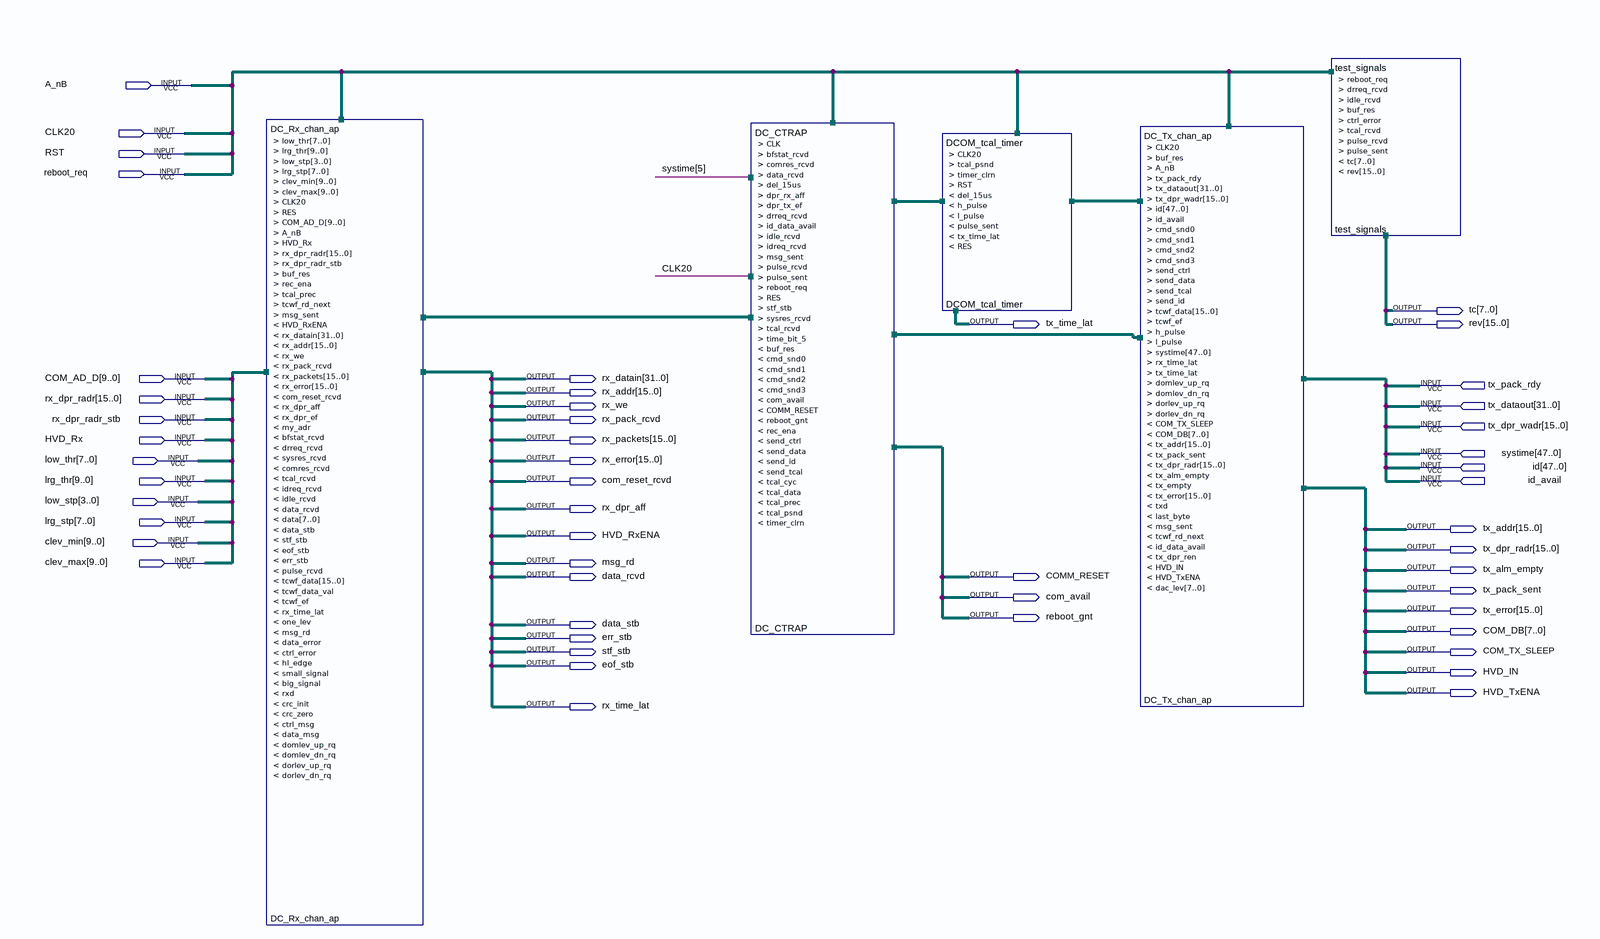
[diagram p0: schematic sheet]
// Quartus schematic dcom_ap_dct.bdf as structural Verilog: 5 symbols, 51 pins
module dcom_ap_dct (
  input  A_nB,
  input  CLK20,
  input  RST,
  input  reboot_req,
  input  [9:0] COM_AD_D,
  input  tx_pack_rdy,
  input  [15:0] rx_dpr_radr,
  input  [31:0] tx_dataout,
  input  rx_dpr_radr_stb,
  input  [15:0] tx_dpr_wadr,
  input  HVD_Rx,
  input  [47:0] systime,
  input  [7:0] low_thr,
  input  [47:0] id,
  input  [9:0] lrg_thr,
  input  id_avail,
  input  [3:0] low_stp,
  input  [7:0] lrg_stp,
  input  [9:0] clev_min,
  input  [9:0] clev_max,
  output [7:0] tc,
  output tx_time_lat,
  output [15:0] rev,
  output [31:0] rx_datain,
  output [15:0] rx_addr,
  output rx_we,
  output rx_pack_rcvd,
  output [15:0] rx_packets,
  output [15:0] rx_error,
  output com_reset_rcvd,
  output rx_dpr_aff,
  output [15:0] tx_addr,
  output HVD_RxENA,
  output [15:0] tx_dpr_radr,
  output msg_rd,
  output tx_alm_empty,
  output data_rcvd,
  output COMM_RESET,
  output tx_pack_sent,
  output com_avail,
  output [15:0] tx_error,
  output reboot_gnt,
  output data_stb,
  output [7:0] COM_DB,
  output err_stb,
  output stf_stb,
  output COM_TX_SLEEP,
  output eof_stb,
  output HVD_IN,
  output HVD_TxENA,
  output rx_time_lat
);

  wire bfstat_rcvd, buf_res, cmd_snd0, cmd_snd1, cmd_snd2, cmd_snd3, comres_rcvd, ctrl_error, del_15us,
       domlev_dn_rq, domlev_up_rq, dorlev_dn_rq, dorlev_up_rq, drreq_rcvd, h_pulse, id_data_avail, idle_rcvd,
       idreq_rcvd, l_pulse, msg_sent, pulse_rcvd, pulse_sent, rec_ena, RES, send_ctrl, send_data, send_id,
       send_tcal, sysres_rcvd, tcal_prec, tcal_psnd, tcal_rcvd, tcwf_ef, tcwf_rd_next, timer_clrn, tx_empty;
  wire [15:0] tcwf_data;

  DC_Rx_chan_ap DC_Rx_chan_ap (
    .low_thr(low_thr), .lrg_thr(lrg_thr), .low_stp(low_stp), .lrg_stp(lrg_stp), .clev_min(clev_min),
    .clev_max(clev_max), .CLK20(CLK20), .RES(RES), .COM_AD_D(COM_AD_D), .A_nB(A_nB), .HVD_Rx(HVD_Rx),
    .rx_dpr_radr(rx_dpr_radr), .rx_dpr_radr_stb(rx_dpr_radr_stb), .buf_res(buf_res), .rec_ena(rec_ena),
    .tcal_prec(tcal_prec), .tcwf_rd_next(tcwf_rd_next), .msg_sent(msg_sent), .HVD_RxENA(HVD_RxENA),
    .rx_datain(rx_datain), .rx_addr(rx_addr), .rx_we(rx_we), .rx_pack_rcvd(rx_pack_rcvd),
    .rx_packets(rx_packets), .rx_error(rx_error), .com_reset_rcvd(com_reset_rcvd), .rx_dpr_aff(rx_dpr_aff),
    .bfstat_rcvd(bfstat_rcvd), .drreq_rcvd(drreq_rcvd), .sysres_rcvd(sysres_rcvd), .comres_rcvd(comres_rcvd),
    .tcal_rcvd(tcal_rcvd), .idreq_rcvd(idreq_rcvd), .idle_rcvd(idle_rcvd), .data_rcvd(data_rcvd),
    .data_stb(data_stb), .stf_stb(stf_stb), .eof_stb(eof_stb), .err_stb(err_stb), .pulse_rcvd(pulse_rcvd),
    .tcwf_data(tcwf_data), .tcwf_ef(tcwf_ef), .rx_time_lat(rx_time_lat), .msg_rd(msg_rd),
    .ctrl_error(ctrl_error), .domlev_up_rq(domlev_up_rq), .domlev_dn_rq(domlev_dn_rq),
    .dorlev_up_rq(dorlev_up_rq), .dorlev_dn_rq(dorlev_dn_rq));  // open: rx_dpr_ef, my_adr, data, tcwf_data_val, one_lev, data_error, hl_edge, small_signal, big_signal, rxd, crc_init, crc_zero, ctrl_msg, data_msg
  DC_CTRAP DC_CTRAP (
    .CLK(CLK20), .bfstat_rcvd(bfstat_rcvd), .comres_rcvd(comres_rcvd), .data_rcvd(data_rcvd),
    .del_15us(del_15us), .dpr_rx_aff(rx_dpr_aff), .dpr_tx_ef(tx_empty), .drreq_rcvd(drreq_rcvd),
    .id_data_avail(id_data_avail), .idle_rcvd(idle_rcvd), .idreq_rcvd(idreq_rcvd), .msg_sent(msg_sent),
    .pulse_rcvd(pulse_rcvd), .pulse_sent(pulse_sent), .reboot_req(reboot_req), .RES(RES), .stf_stb(stf_stb),
    .sysres_rcvd(sysres_rcvd), .tcal_rcvd(tcal_rcvd), .time_bit_5(systime[5]), .buf_res(buf_res),
    .cmd_snd0(cmd_snd0), .cmd_snd1(cmd_snd1), .cmd_snd2(cmd_snd2), .cmd_snd3(cmd_snd3),
    .com_avail(com_avail), .COMM_RESET(COMM_RESET), .reboot_gnt(reboot_gnt), .rec_ena(rec_ena),
    .send_ctrl(send_ctrl), .send_data(send_data), .send_id(send_id), .send_tcal(send_tcal),
    .tcal_prec(tcal_prec), .tcal_psnd(tcal_psnd), .timer_clrn(timer_clrn));  // open: tcal_cyc, tcal_data
  DCOM_tcal_timer DCOM_tcal_timer (
    .CLK20(CLK20), .tcal_psnd(tcal_psnd), .timer_clrn(timer_clrn), .RST(RST), .del_15us(del_15us),
    .h_pulse(h_pulse), .l_pulse(l_pulse), .pulse_sent(pulse_sent), .tx_time_lat(tx_time_lat), .RES(RES));
  DC_Tx_chan_ap DC_Tx_chan_ap (
    .CLK20(CLK20), .buf_res(buf_res), .A_nB(A_nB), .tx_pack_rdy(tx_pack_rdy), .tx_dataout(tx_dataout),
    .tx_dpr_wadr(tx_dpr_wadr), .id(id), .id_avail(id_avail), .cmd_snd0(cmd_snd0), .cmd_snd1(cmd_snd1),
    .cmd_snd2(cmd_snd2), .cmd_snd3(cmd_snd3), .send_ctrl(send_ctrl), .send_data(send_data),
    .send_tcal(send_tcal), .send_id(send_id), .tcwf_data(tcwf_data), .tcwf_ef(tcwf_ef), .h_pulse(h_pulse),
    .l_pulse(l_pulse), .systime(systime), .rx_time_lat(rx_time_lat), .tx_time_lat(tx_time_lat),
    .domlev_up_rq(domlev_up_rq), .domlev_dn_rq(domlev_dn_rq), .dorlev_up_rq(dorlev_up_rq),
    .dorlev_dn_rq(dorlev_dn_rq), .COM_TX_SLEEP(COM_TX_SLEEP), .COM_DB(COM_DB), .tx_addr(tx_addr),
    .tx_pack_sent(tx_pack_sent), .tx_dpr_radr(tx_dpr_radr), .tx_alm_empty(tx_alm_empty), .tx_error(tx_error),
    .msg_sent(msg_sent), .tcwf_rd_next(tcwf_rd_next), .id_data_avail(id_data_avail), .HVD_IN(HVD_IN),
    .HVD_TxENA(HVD_TxENA));  // open: tx_empty, txd, last_byte, tx_dpr_ren, dac_lev
  test_signals test_signals (
    .reboot_req(reboot_req), .drreq_rcvd(drreq_rcvd), .idle_rcvd(idle_rcvd), .buf_res(buf_res),
    .ctrl_error(ctrl_error), .tcal_rcvd(tcal_rcvd), .pulse_rcvd(pulse_rcvd), .pulse_sent(pulse_sent),
    .tc(tc), .rev(rev));
endmodule
